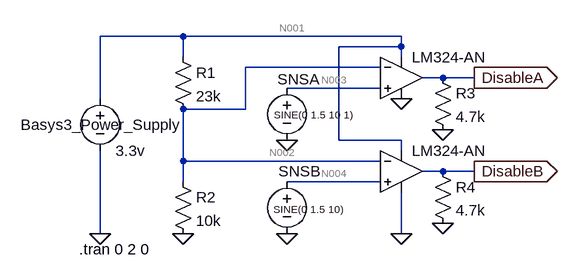
[diagram p0: schematic DualComparatorOverCurrent.asc]
DualComparatorOverCurrent.asc, the LTspice schematic file:
Version 4
SHEET 1 880 680
WIRE 96 16 -32 16
WIRE 432 16 96 16
WIRE 432 32 432 16
WIRE 432 32 336 32
WIRE 96 48 96 16
WIRE 432 48 432 32
WIRE 400 64 192 64
WIRE 496 80 464 80
WIRE 544 80 496 80
WIRE 400 96 256 96
WIRE -32 112 -32 16
WIRE 192 128 192 64
WIRE 192 128 96 128
WIRE 336 176 336 32
WIRE 432 176 336 176
WIRE 432 192 432 176
WIRE 96 208 96 128
WIRE 400 208 96 208
WIRE 496 224 464 224
WIRE 544 224 496 224
WIRE 96 240 96 208
WIRE 400 240 256 240
WIRE -32 320 -32 192
WIRE 432 320 432 256
FLAG -32 320 0
FLAG 96 320 0
FLAG 256 176 0
FLAG 256 320 0
FLAG 432 112 0
FLAG 432 320 0
FLAG 544 80 DisableA
IOPIN 544 80 Out
FLAG 544 224 DisableB
IOPIN 544 224 Out
FLAG 496 160 0
FLAG 496 304 0
SYMBOL voltage -32 96 R0
WINDOW 123 0 0 Left 0
WINDOW 39 0 0 Left 0
WINDOW 0 -122 56 Left 2
SYMATTR InstName Basys3_Power_Supply
SYMATTR Value 3.3v
SYMBOL res 80 32 R0
SYMATTR InstName R1
SYMATTR Value 23k
SYMBOL res 80 224 R0
SYMATTR InstName R2
SYMATTR Value 10k
SYMBOL voltage 256 224 R0
WINDOW 0 -13 0 Left 2
WINDOW 3 -21 58 Left 1
WINDOW 123 0 0 Left 0
WINDOW 39 0 0 Left 0
SYMATTR InstName SNSB
SYMATTR Value SINE(0 1.5 10)
SYMBOL voltage 256 80 R0
WINDOW 0 -15 2 Left 2
WINDOW 3 -20 57 Left 1
WINDOW 123 0 0 Left 0
WINDOW 39 0 0 Left 0
SYMATTR InstName SNSA
SYMATTR Value SINE(0 1.5 10 1)
SYMBOL UniversalOpAmp 432 224 R0
SYMATTR InstName LM324-AN
SYMBOL UniversalOpAmp 432 80 R0
SYMATTR InstName LM324-AN
SYMBOL res 480 64 R0
SYMATTR InstName R3
SYMATTR Value 4.7k
SYMBOL res 480 208 R0
SYMATTR InstName R4
SYMATTR Value 4.7k
TEXT -64 344 Left 2 !.tran 0 2 0

The netlist it stands for:
* DualComparatorOverCurrent.asc
V§Basys3_Power_Supply N001 0 3.3v
R1 N001 N002 23k
R2 N002 0 10k
V§SNSB N004 0 SINE(0 1.5 10)
V§SNSA N003 0 SINE(0 1.5 10 1)
XLM324-AN N004 N002 N001 0 DisableB level1 Avol=1Meg GBW=10Meg Vos=0 En=0 Enk=0 In=0 Ink=0 Rin=500Meg  ; pins In+ In- V+ V- OUT
XLM324-AN N003 N002 N001 0 DisableA level1 Avol=1Meg GBW=10Meg Vos=0 En=0 Enk=0 In=0 Ink=0 Rin=500Meg  ; pins In+ In- V+ V- OUT
R3 DisableA 0 4.7k
R4 DisableB 0 4.7k
.tran 0 2 0
.lib UniversalOpAmp1.lib
.backanno
.end

* Results of the author's LTspice run, read from the files saved beside the schematic
* Operating Point, zero values left out:
*   V(n001) = 3.3 V
*   V(n002) = 652.2 mV
*   V(disablea) = 3.253 V
*   V(disableb) = 3.253 V
*   I(R1) = 115.1 µA
*   I(R2) = 65.22 µA
*   I(R3) = 692.1 µA
*   I(R4) = 692.1 µA
*   I(Basys3_power_supply) = -4.999 mA
*   I(Snsb) = 24.95 µA
*   I(Snsa) = 24.95 µA
*   Ix(u1:1) = -24.95 µA
*   Ix(u1:2) = 24.95 µA
*   Ix(u1:3) = 2.442 mA
*   Ix(u1:4) = -1.762 mA
*   Ix(u1:5) = -692 µA
*   Ix(u2:1) = -24.95 µA
*   Ix(u2:2) = 24.95 µA
*   Ix(u2:3) = 2.442 mA
*   Ix(u2:4) = -1.762 mA
*   Ix(u2:5) = -692 µA
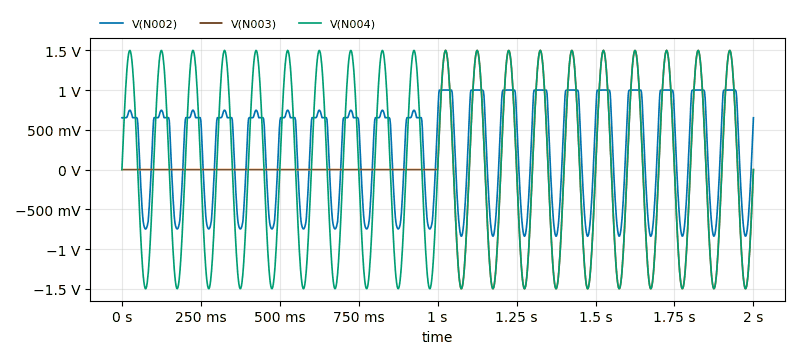
[diagram p1: Transient Analysis of DualComparatorOverCurrent.asc, plotted from the saved traces]
* Transient Analysis, 1 run:
*   V(N002): min -839.1 mV, max 1.001 V, average 267.3 mV, rms 701.5 mV, last 652.2 mV
*   V(N003): min -1.499 V, max 1.5 V, average 8.967 µV, rms 750 mV, last 0 V
*   V(N004): min -1.5 V, max 1.5 V, average 13.29 µV, rms 1.061 V, last 0 V